# Altium schematic sheet Peripheral.SchDoc: Peripherals
size A4; Organization: ORGANIZATION; Address1: ADDRESS 1; Address2: ADDRESS 2; Address3: ADDRESS 3; Address4: ADDRESS 4; Revision: -; SheetNumber: 10; SheetTotal: 11; ENG_APP_DATE: --/--/--; DSN_APP_DATE: --/--/--; CHK_APP_DATE: --/--/--
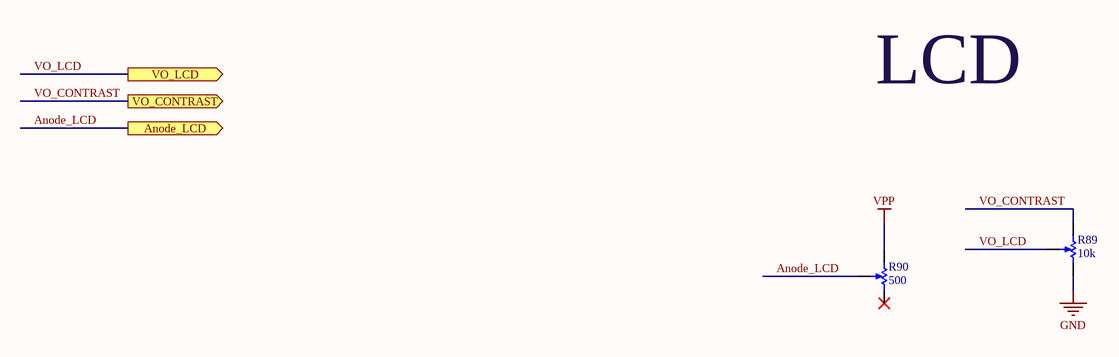
[diagram p0: Peripheral.SchDoc]

## Parts
R89  value 10k  [BI-35WR10KLFTR-3_V]  (hidden comment: TC33X-2-103G)
R90  value 500  [BOUR-TC33X-2_V]  (hidden comment: TC33X-2-501E)

## Ports
Anode_LCD (out), VO_CONTRAST (out), VO_LCD (out)

## Nets
GND: R89.3
VPP: R90.1
Anode_LCD: R90.2 ; port Anode_LCD
VO_CONTRAST: R89.1 ; port VO_CONTRAST
VO_LCD: R89.2 ; port VO_LCD

Not connected (* = marked no-connect by the designer): R90 3*

## Notes on the sheet
- LCD
- APPROVALS
- DATE
- PROJECT
- Kish Spark Building
- No. 8, Avesta Street
- ENG:
- DSN:
- CHK:
- PROJECT REVISION:
- DESIGN ITEM:
- DOCUMENT REVISION:
- Tehran, Iran
- Seoul Street, Sheikh Bahaie
- SIZE
- REV
- SCALE:
- CAGE CODE
- A4
- FILE NAME
- TITLE
- SHEET
- OF

## Library data of the parts
R89 = CMP-009-00317-1: Res Trimmer 10K Ohm 25% 1/10W 1(Elec)/1(Mech)Turn (3 X 3.8mm) Foot Print SMD Embossed T/R; Max Power Dissipation: 100mW; Temperature Coefficient: 250ppm/°C; Max Operating Temperature: 100°C; Min Operating Temperature: -40°C; Mounting Technology: Surface Mount; RoHS Compliant: Yes; Tolerance: 25%; Depth: 3.8mm; Height: 0.047inch; Length: 0.15inch; Military Standard: Not; Package Quantity: 9000; Packaging: Tape and Reel; Power Rating: 100mW; Radiation Hardening: No; Resistor Type: Cermet; Series: Trimpot® TC33 - Open Frame; Termination: SMD/SMT; Width: 0.118inch
R90 = CMP-009-00318-1: Res Trimmer 500 Ohm 25% 1/10W 1(Elec)/1(Mech)Turn (3 X 3.8mm) Foot Print SMD Embossed T/R; Power: 100mW; Number of Turns: 1; Temperature Coefficient: 250ppm/°C; Case/Package: TC33X-2; RoHS Compliant: Yes; Mounting Technology: Surface Mount; Max Operating Temperature: 100°C; Min Operating Temperature: -40°C; Tolerance: 25%; Height: 0.047inch; Length: 0.15inch; Max Power Dissipation: 100mW; Package Quantity: 1; Packaging: Tape and Reel; Power Rating: 100mW; Radiation Hardening: No; Reach SVHC Compliant: No; Resistance Tolerance: 25%; Resistor Type: Cermet; Series: Trimpot® TC33 - Open Frame; Termination: SMD/SMT; Width: 0.118inch